# Altium schematic sheet 28Pins.SchDoc (part 3 of 3)
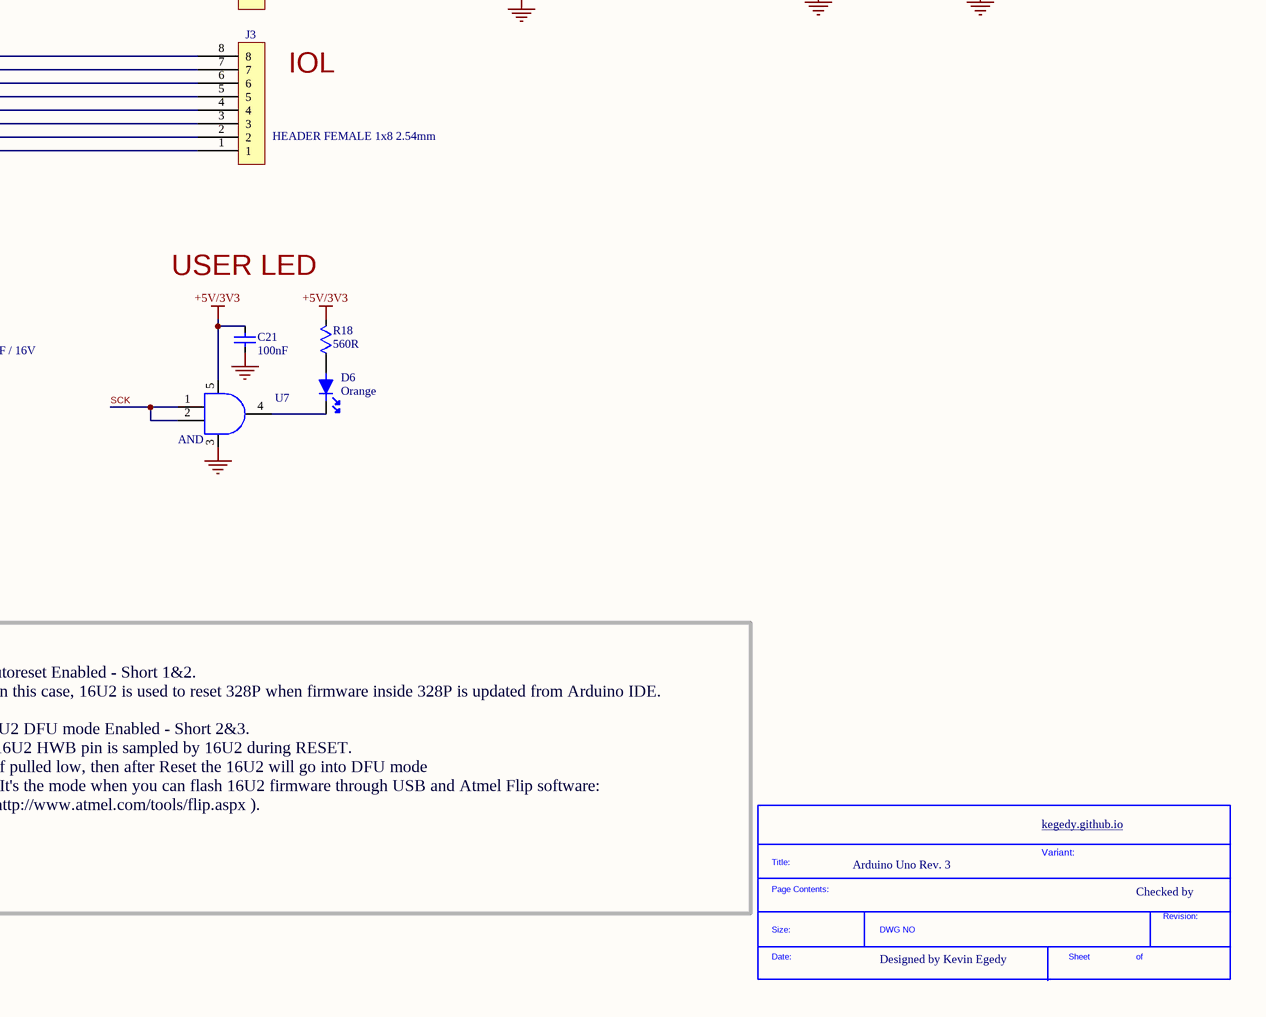
[diagram p5: 28Pins.SchDoc, bottom right]

## Library data of the parts (continued)
R6 R8 R11 R12 R18 = RC0805FR-07560RL: Res General Purpose Thick Film 0805 560 Ohm 1% 1/8W ±100ppm/°C Molded Paper T/R; Manufacturer: Yageo; Power Rating: 125mW; Voltage Rating: 150V; Supplier 1: Digi-Key; Manufacturer Part Number: RC0805FR-07560RL; RoHS: Yes; Category: Chip SMD Resistors; Stock 1: 291591; Pricing 1: 1=0.10000, 10=0.03300, 100=0.01330, 1000=0.00600, 2500=0.00520 (USD); Case/Package: 0805; Case Code (Metric): 2012; Case Code (Imperial): 0805; Weight: 0.000194oz; Min Operating Temperature: -55°C; Max Operating Temperature: 155°C; Resistor Type: Thick Film; Tolerance: 1%; Value: 560R; Package Quantity: 1; Packaging: Cut Tape; Number of Terminations: 2; Termination: SMD/SMT; Max Power Dissipation: 125mW; Temperature Coefficient: 100ppm/°C; Features: Moisture Resistant; Series: RC; Resistance Tolerance: 1%; Construction: Rectangular; Length: 0.079inch; Width: 0.049inch; Height: 0.024inch; Depth: 1.25mm; RoHS Compliant: Yes; Military Standard: Not; Lead Free: Lead Free; ComponentLink1URL: https://datasheet.ciiva.com/2457/pyu-r-int-thick-7-2457141.pdf?src-supplier=Digi-Key; ComponentLink1Description: https://datasheet.ciiva.com/2457/pyu-r-int-thick-7-2457141.pdf?src-supplier=Digi-Key; ComponentLink2URL: https://datasheet.ciiva.com/2457/pyu-r-int-thick-7-2457142.pdf?src-supplier=Digi-Key; ComponentLink2Description: https://datasheet.ciiva.com/2457/pyu-r-int-thick-7-2457142.pdf?src-supplier=Digi-Key; ComponentLink3URL: https://datasheet.ciiva.com/2457/pyu-r-int-thick-7-2457140.pdf?src-supplier=Digi-Key; ComponentLink3Description: https://datasheet.ciiva.com/2457/pyu-r-int-thick-7-2457140.pdf?src-supplier=Digi-Key; ComponentLink4URL: https://datasheet.ciiva.com/5561/rc0805-5561861.pdf?src-supplier=Mouser; ComponentLink4Description: https://datasheet.ciiva.com/5561/rc0805-5561861.pdf?src-supplier=Mouser; ComponentLink5URL: https://datasheet.ciiva.com/7941/444164-7941814.pdf?src-supplier=Element14; ComponentLink5Description: https://datasheet.ciiva.com/7941/444164-7941814.pdf?src-supplier=Element14; ComponentLink6URL: https://datasheet.ciiva.com/7941/444164-7941813.pdf?src-supplier=Element14; ComponentLink6Description: https://datasheet.ciiva.com/7941/444164-7941813.pdf?src-supplier=Element14; Supplier Part Number 1: 311-560CRCT-ND
R10 = RC0805FR-07100KL: Res Thick Film 0805 100K Ohm 1% 1/8W ±100ppm/°C Molded SMD Paper T/R; Manufacturer: Yageo; Value: 100kR; Power Rating: 125mW; Voltage Rating (DC): 150V; Supplier 1: Digi-Key; Manufacturer Part Number: RC0805FR-07100KL; RoHS: Yes; Category: Chip SMD Resistors; Stock 1: 5892950; Pricing 1: 1=0.10000, 10=0.03300, 100=0.01330, 1000=0.00600, 2500=0.00520 (USD); Case/Package: 0805; Pins: 2; Case Code (Metric): 2012; Case Code (Imperial): 0805; Min Operating Temperature: -55°C; Max Operating Temperature: 155°C; Resistor Type: Thick Film; Tolerance: 1%; Packaging: Tape and Reel; Temperature Coefficient: 100ppm/°C; Voltage Rating: 150V; Package Quantity: 1; Number of Terminations: 2; Termination: SMD/SMT; Max Power Dissipation: 125mW; Features: Moisture Resistant; Series: RC; Construction: Rectangular; Resistance Tolerance: 1%; Technology: THICK FILM; Length: 0.079inch; Width: 0.049inch; Height: 0.024inch; Depth: 1.25mm; Lead Pitch: 0.4mm; Lead Free: Lead Free; RoHS Compliant: Yes; Military Standard: Not; ComponentLink1URL: https://datasheet.ciiva.com/11808/0900766b8106beab-11808858.pdf?src-supplier=Rs; ComponentLink1Description: https://datasheet.ciiva.com/11808/0900766b8106beab-11808858.pdf?src-supplier=Rs; ComponentLink2URL: https://datasheet.ciiva.com/7941/1686128-7941677.pdf?src-supplier=Element14; ComponentLink2Description: https://datasheet.ciiva.com/7941/1686128-7941677.pdf?src-supplier=Element14; ComponentLink3URL: https://datasheet.ciiva.com/7660/38627-7660796.pdf?src-supplier=Element14; ComponentLink3Description: https://datasheet.ciiva.com/7660/38627-7660796.pdf?src-supplier=Element14; ComponentLink4URL: https://datasheet.ciiva.com/22747/444164-22747534.pdf?src-supplier=Element14; ComponentLink4Description: https://datasheet.ciiva.com/22747/444164-22747534.pdf?src-supplier=Element14; ComponentLink5URL: https://datasheet.ciiva.com/2457/pyu-r-int-thick-7-2457018.pdf?src-supplier=Digi-Key; ComponentLink5Description: https://datasheet.ciiva.com/2457/pyu-r-int-thick-7-2457018.pdf?src-supplier=Digi-Key; ComponentLink6URL: https://datasheet.ciiva.com/2457/pyu-r-int-thick-7-2457019.pdf?src-supplier=Digi-Key; ComponentLink6Description: https://datasheet.ciiva.com/2457/pyu-r-int-thick-7-2457019.pdf?src-supplier=Digi-Key; ComponentLink7URL: https://datasheet.ciiva.com/2457/pyu-r-int-thick-7-2457017.pdf?src-supplier=Digi-Key; ComponentLink7Description: https://datasheet.ciiva.com/2457/pyu-r-int-thick-7-2457017.pdf?src-supplier=Digi-Key; ComponentLink8URL: https://datasheet.ciiva.com/12667/rc0805-12667001.pdf?src-supplier=Mouser; ComponentLink8Description: https://datasheet.ciiva.com/12667/rc0805-12667001.pdf?src-supplier=Mouser; ComponentLink9URL: https://datasheet.ciiva.com/7941/1697719-7941676.pdf?src-supplier=Element14; ComponentLink9Description: https://datasheet.ciiva.com/7941/1697719-7941676.pdf?src-supplier=Element14; ComponentLink10URL: https://datasheet.ciiva.com/7941/1697719-7941678.pdf?src-supplier=Element14; ComponentLink10Description: https://datasheet.ciiva.com/7941/1697719-7941678.pdf?src-supplier=Element14; ComponentLink11URL: https://datasheet.ciiva.com/16747/rc0805-16747226.pdf?src-supplier=Future+Electronics; ComponentLink11Description: https://datasheet.ciiva.com/16747/rc0805-16747226.pdf?src-supplier=Future+Electronics; Supplier Part Number 1: 311-100KCRCT-ND
R16 R22 = RC0805FR-071ML: Res Thick Film 0805 1M Ohm 1% 0.125W(1/8W) ±100ppm/C Pad SMD T/R; Manufacturer: Yageo; Power Rating: 125mW; Value: 1MR; Voltage Rating: 150V; Temperature Coefficient: 250ppm/°C; Supplier 1: Digi-Key; Manufacturer Part Number: RC0805FR-071ML; RoHS: Yes; Category: Chip SMD Resistors; Stock 1: 1798431; Pricing 1: 1=0.10000, 10=0.03300, 100=0.01330, 1000=0.00600, 2500=0.00520 (USD); Case/Package: Molded; Case Code (Metric): 2012; Case Code (Imperial): 0805; Min Operating Temperature: -55°C; Max Operating Temperature: 155°C; Resistor Type: Thick Film; Package Quantity: 1; Tolerance: 1%; Packaging: Tape and Reel; Number of Terminations: 2; Termination: SMD/SMT; Max Power Dissipation: 125mW; Features: Moisture Resistant; Series: RC; Construction: Rectangular; Resistance Tolerance: 1%; Length: 2mm; Width: 0.049inch; Height: 0.024inch; Depth: 1.25mm; RoHS Compliant: Yes; Military Standard: Not; Lead Free: Lead Free; ComponentLink1URL: https://datasheet.ciiva.com/12666/rc0805-12666975.pdf?src-supplier=Mouser; ComponentLink1Description: https://datasheet.ciiva.com/12666/rc0805-12666975.pdf?src-supplier=Mouser; ComponentLink2URL: https://datasheet.ciiva.com/2519/pyu-r-int-thick-7-2519711.pdf?src-supplier=Digi-Key; ComponentLink2Description: https://datasheet.ciiva.com/2519/pyu-r-int-thick-7-2519711.pdf?src-supplier=Digi-Key; ComponentLink3URL: https://datasheet.ciiva.com/2519/pyu-r-int-thick-7-2519712.pdf?src-supplier=Digi-Key; ComponentLink3Description: https://datasheet.ciiva.com/2519/pyu-r-int-thick-7-2519712.pdf?src-supplier=Digi-Key; ComponentLink4URL: https://datasheet.ciiva.com/2519/pyu-r-int-thick-7-2519713.pdf?src-supplier=Digi-Key; ComponentLink4Description: https://datasheet.ciiva.com/2519/pyu-r-int-thick-7-2519713.pdf?src-supplier=Digi-Key; ComponentLink5URL: https://datasheet.ciiva.com/17419/rc0805-17419909.pdf?src-supplier=Future+Electronics; ComponentLink5Description: https://datasheet.ciiva.com/17419/rc0805-17419909.pdf?src-supplier=Future+Electronics; Supplier Part Number 1: 311-1.00MCRDKR-ND
R23-R25 = RC0805FR-071KL: RES SMD 1K OHM 1% 1/8W 0805; Manufacturer: Yageo; Value: 1kR; Temperature Coefficient: 100ppm/°C; Voltage Rating (DC): 150V; Power Rating: 125mW; Supplier 1: Digi-Key; Manufacturer Part Number: RC0805FR-071KL; RoHS: Yes; Category: Chip SMD Resistors; Stock 1: 8245666; Pricing 1: 1=0.10000, 10=0.03300, 100=0.01330, 1000=0.00600, 2500=0.00520 (USD); Case/Package: 0805; Pins: 2; Case Code (Metric): 2012; Case Code (Imperial): 0805; Min Operating Temperature: -55°C; Max Operating Temperature: 155°C; Tolerance: 1%; Resistor Type: Thick Film; Packaging: Tape and Reel; Package Quantity: 1; Voltage Rating: 150V; Number of Terminations: 2; Termination: SMD/SMT; Max Power Dissipation: 125mW; Features: Moisture Resistant; Series: RC; Resistance Tolerance: 1%; Construction: Rectangular; Length: 0.079inch; Width: 0.049inch; Height: 0.024inch; Depth: 1.25mm; Reach SVHC Compliant: Yes; Lead Free: Lead Free; RoHS Compliant: Yes; Military Standard: Not; ComponentLink1URL: https://datasheet.ciiva.com/7941/1686128-7941719.pdf?src-supplier=Element14; ComponentLink1Description: https://datasheet.ciiva.com/7941/1686128-7941719.pdf?src-supplier=Element14; ComponentLink2URL: https://datasheet.ciiva.com/46385/444164-46385020.pdf?src-supplier=Element14; ComponentLink2Description: https://datasheet.ciiva.com/46385/444164-46385020.pdf?src-supplier=Element14; ComponentLink3URL: https://datasheet.ciiva.com/2456/pyu-r-int-thick-7-2456976.pdf?src-supplier=Digi-Key; ComponentLink3Description: https://datasheet.ciiva.com/2456/pyu-r-int-thick-7-2456976.pdf?src-supplier=Digi-Key; ComponentLink4URL: https://datasheet.ciiva.com/2456/pyu-r-int-thick-7-2456977.pdf?src-supplier=Digi-Key; ComponentLink4Description: https://datasheet.ciiva.com/2456/pyu-r-int-thick-7-2456977.pdf?src-supplier=Digi-Key; ComponentLink5URL: https://datasheet.ciiva.com/2456/pyu-r-int-thick-7-2456975.pdf?src-supplier=Digi-Key; ComponentLink5Description: https://datasheet.ciiva.com/2456/pyu-r-int-thick-7-2456975.pdf?src-supplier=Digi-Key; ComponentLink6URL: https://datasheet.ciiva.com/16850/rc0805-16850409.pdf?src-supplier=Future+Electronics; ComponentLink6Description: https://datasheet.ciiva.com/16850/rc0805-16850409.pdf?src-supplier=Future+Electronics; Supplier Part Number 1: 311-1.00KCRCT-ND
SCKT1 = 4828-3004-CP: Socket DIP 28Cnts DualWipe 0.3InSpc. PhosphorBronze Nickel KinkedTail 4800Series; Manufacturer: 3M; Number of Contacts: 28; Gender: Female; Insulation Resistance: 5GR; Current Rating: 1A; Pitch: 2.54mm; Row Spacing: 7.62mm; Supplier 1: Digi-Key; Manufacturer Part Number: 4828-3004-CP; RoHS: Yes; Category: Connectors; Stock 1: 14978; Pricing 1: 1=1.06000, 10=0.89600, 25=0.85880, 50=0.84060, 100=0.80410, 250=0.73104, 500=0.65794, 1000=0.58483, 2500=0.53000 (USD); Mounting Technology: Through Hole; Contact Plating: Tin; Contact Material: Bronze; Housing Material: Glass; Insulation Material: Polyester; Contact Finish - Mating: TIN; Min Operating Temperature: -25°C; Max Operating Temperature: 85°C; Number of Rows: 2; Termination: Solder; Orientation: Straight; Packaging: Rail/Tube; Package Quantity: 5600; Number of Positions: 28; Connector Type: DIP; Series: 4800; Length: 35.43mm; Width: 10.16mm; Depth: 10.16mm; Lead Free: Lead Free; RoHS Compliant: Yes; Flammability Rating: UL94 V-0; ComponentLink1URL: https://datasheet.ciiva.com/768/ts1099-768354.pdf?src-supplier=Digi-Key; ComponentLink1Description: https://datasheet.ciiva.com/768/ts1099-768354.pdf?src-supplier=Digi-Key; Supplier Part Number 1: 3M5480-ND
SW1 SW2 = 1825910-6: Switch Tactile OFF (ON) SPST Round Button PC Pins 0.05A 24VDC 1.57N Thru-Hole Loose; Manufacturer: TE Connectivity Alcoswitch; Mechanical Life: 100000Cycles; Actuator Material: PBT; Actuator Color: Black; Operating Force: 160gf; Illumination Type: Non-Illuminated,Illuminated; Switch Travel: 0.25mm; Contact Current Rating: 50mA; Switch Function: Off-Mom; Max Voltage Rating (DC): 24V; Contact Resistance: 100mR; Actuator Type: Standard; Actuator Length: 0.055inch; Supplier 1: Digi-Key; Manufacturer Part Number: 1825910-6; RoHS: Yes; Category: Pushbutton Switches; Stock 1: 79914; Pricing 1: 1=0.13000, 10=0.12500, 25=0.11840, 100=0.10780, 250=0.10132, 500=0.09268, 1000=0.07759, 2500=0.07544, 5000=0.07113 (USD); Mounting Technology: Through Hole; Contact Material: Copper Alloy; Contact Plating: Silver; Min Operating Temperature: -35°C; Max Operating Temperature: 85°C; Termination: PC Pins; Series: FSMJ; Throw Configuration: SPST; Package Quantity: 750; Packaging: Loose Piece; Orientation: Straight; Type: Switch; Max Current Rating: 50mA; Electrical Life: 100000Cycles; Length: 5.99mm; RoHS Compliant: Yes; ELV: Compliant; Lead Free: Lead Free; ComponentLink1URL: https://datasheet.ciiva.com/30199/1825910-6rqpn1825910-6-30199520.pdf?src-supplier=Onlinecomponents.com; ComponentLink1Description: https://datasheet.ciiva.com/30199/1825910-6rqpn1825910-6-30199520.pdf?src-supplier=Onlinecomponents.com; ComponentLink2URL: https://datasheet.ciiva.com/15184/getdatasheetpartid-395915-15184509.pdf?src-supplier=Verical; ComponentLink2Description: https://datasheet.ciiva.com/15184/getdatasheetpartid-395915-15184509.pdf?src-supplier=Verical; Supplier Part Number 1: 450-1650-ND
U1 = ATMEGA328P-PU: ATMEGA328P-PU; 8 bit Microcontroller AVR 20MHz 1; 32kb Flash; 2kb RAM; I2C SPI 2; Manufacturer: Microchip / Atmel; Number of PWM Channels: 6; Number of Timers/Counters: 3; Min Supply Voltage: 1.8V; Max Supply Voltage: 5.5V; Interface: I2C,SPI,UART,USART,2-Wire; Number of I/Os: 23; Oscillator Type: Internal; Data Bus Width: 8b; Number of SPI Channels: 1; Watchdog Timer: Yes; Peripherals: Brown-out Detect/Reset,POR,PWM,WDT; Supplier 1: Digi-Key; Manufacturer Part Number: ATMEGA328P-PU; RoHS: Yes; Category: Microcontrollers; Mount: Through Hole; Case/Package: PDIP; Number of Pins: 28; Contact Plating: Tin,Matte; Min Operating Temperature: -40°C; Max Operating Temperature: 85°C; Package Quantity: 14; Core Architecture: AVR; Series: AVR® ATmega; RAM Size: 2KB; Number of ADC Channels: 6; Packaging: Rail/Tube; Frequency: 20MHz; Number of Programmable I/O: 23; Max Frequency: 20MHz; Number of I2C Channels: 1; Memory Type: FLASH; Memory Size: 32KB; Length: 37.4mm; Width: 6.76mm; Height: 3.28mm; Radiation Hardening: No; REACH SVHC: No SVHC; Lead Free: Lead Free; RoHS Compliant: Yes; ComponentLink1URL: https://datasheet.ciiva.com/19457/2139111-19457070.pdf?src-supplier=Jameco; ComponentLink1Description: https://datasheet.ciiva.com/19457/2139111-19457070.pdf?src-supplier=Jameco; ComponentLink2URL: https://datasheet.ciiva.com/1157/1684409-1157696.pdf?src-supplier=Element14; ComponentLink2Description: https://datasheet.ciiva.com/1157/1684409-1157696.pdf?src-supplier=Element14; ComponentLink3URL: https://datasheet.ciiva.com/20168/73-4283-20168380.pdf?src-supplier=Rapid+Electronics; ComponentLink3Description: https://datasheet.ciiva.com/20168/73-4283-20168380.pdf?src-supplier=Rapid+Electronics; ComponentLink4URL: https://datasheet.ciiva.com/29119/155197-da-01-en-microcontr-atmega328p-pu-8bit-pdip-28-29119593.pdf?src-supplier=Conrad; ComponentLink4Description: https://datasheet.ciiva.com/29119/155197-da-01-en-microcontr-atmega328p-pu-8bit-pdip-28-29119593.pdf?src-supplier=Conrad; ComponentLink5URL: https://datasheet.ciiva.com/26818/atmega328p-pu-26818578.pdf?src-supplier=IIIC; ComponentLink5Description: https://datasheet.ciiva.com/26818/atmega328p-pu-26818578.pdf?src-supplier=IIIC; ComponentLink6URL: https://datasheet.ciiva.com/15213/getdatasheetpartid-318533-15213133.pdf?src-supplier=Verical; ComponentLink6Description: https://datasheet.ciiva.com/15213/getdatasheetpartid-318533-15213133.pdf?src-supplier=Verical; Supplier Part Number 1: ATMEGA328P-PU-ND
U2 = ATMEGA16U2-AU: 8-bit AVR MCU, 16 KB, 512 Bytes, 16 MHz, 2.7 to 5.5V, TQFP-32, RoHS; Manufacturer: Microchip; Interface: SPI,USB,UART,USART; Memory Type: FLASH; Frequency: 16MHz; Memory Size: 16KB; Peripherals: Brown-out Detect/Reset,POR,PWM,WDT; Number of I/Os: 22; Oscillator Type: Internal; Supplier 1: Digi-Key; Manufacturer Part Number: ATMEGA16U2-AU; RoHS: Yes; Category: Microcontrollers; Pricing 1: 1=3.16000, 25=2.90960, 100=2.63350 (USD); Case/Package: TQFP; Number of Pins: 32; Min Operating Temperature: -40°C; Max Operating Temperature: 85°C; Packaging: Tray; Core Architecture: AVR; RoHS Compliant: Yes; ComponentLink1URL: http://www.farnell.com/datasheets/1795896.pdf?src-supplier=Farnell; ComponentLink1Description: http://www.farnell.com/datasheets/1795896.pdf?src-supplier=Farnell; ComponentLink2URL: http://www.microchip.com/mymicrochip/filehandler.aspx?ddocname=en590463&src-supplier=Onlinecomponents.com; ComponentLink2Description: http://www.microchip.com/mymicrochip/filehandler.aspx?ddocname=en590463&src-supplier=Onlinecomponents.com; ComponentLink3URL: http://www.microchip.com/mymicrochip/filehandler.aspx?ddocname=en590463&src-supplier=RSComponents; ComponentLink3Description: http://www.microchip.com/mymicrochip/filehandler.aspx?ddocname=en590463&src-supplier=RSComponents; ComponentLink4URL: http://www.farnell.com/datasheets/1795896.pdf?src-supplier=Element14; ComponentLink4Description: http://www.farnell.com/datasheets/1795896.pdf?src-supplier=Element14; ComponentLink5URL: http://www.microchip.com/mymicrochip/filehandler.aspx?ddocname=en590463&src-supplier=Mouser; ComponentLink5Description: http://www.microchip.com/mymicrochip/filehandler.aspx?ddocname=en590463&src-supplier=Mouser; ComponentLink6URL: http://www.microchip.com/mymicrochip/filehandler.aspx?ddocname=en590463&src-supplier=Avnet; ComponentLink6Description: http://www.microchip.com/mymicrochip/filehandler.aspx?ddocname=en590463&src-supplier=Avnet; ComponentLink7URL: http://www.microchip.com/mymicrochip/filehandler.aspx?ddocname=en590463&src-supplier=Arrow+Electronics; ComponentLink7Description: http://www.microchip.com/mymicrochip/filehandler.aspx?ddocname=en590463&src-supplier=Arrow+Electronics; ComponentLink8URL: http://www.microchip.com/mymicrochip/filehandler.aspx?ddocname=en590463&src-supplier=Verical; ComponentLink8Description: http://www.microchip.com/mymicrochip/filehandler.aspx?ddocname=en590463&src-supplier=Verical; ComponentLink9URL: http://www.microchip.com/mymicrochip/filehandler.aspx?ddocname=en590463&src-supplier=Avnet+Europe; ComponentLink9Description: http://www.microchip.com/mymicrochip/filehandler.aspx?ddocname=en590463&src-supplier=Avnet+Europe; ComponentLink10URL: http://www.microchip.com/mymicrochip/filehandler.aspx?ddocname=en590463&src-supplier=Avnet+Asia; ComponentLink10Description: http://www.microchip.com/mymicrochip/filehandler.aspx?ddocname=en590463&src-supplier=Avnet+Asia; ComponentLink11URL: http://www.microchip.com/mymicrochip/filehandler.aspx?ddocname=en590463&src-supplier=Digi-Key; ComponentLink11Description: http://www.microchip.com/mymicrochip/filehandler.aspx?ddocname=en590463&src-supplier=Digi-Key; ComponentLink12URL: http://www.microchip.com/mymicrochip/filehandler.aspx?ddocname=en590463&src-supplier=TME; ComponentLink12Description: http://www.microchip.com/mymicrochip/filehandler.aspx?ddocname=en590463&src-supplier=TME; ComponentLink13URL: http://www.microchip.com/mymicrochip/filehandler.aspx?ddocname=en590463&src-supplier=microchipDIRECT; ComponentLink13Description: http://www.microchip.com/mymicrochip/filehandler.aspx?ddocname=en590463&src-supplier=microchipDIRECT; ComponentLink14URL: http://www.microchip.com/mymicrochip/filehandler.aspx?ddocname=en590463&src-supplier=Electro+Sonic; ComponentLink14Description: http://www.microchip.com/mymicrochip/filehandler.aspx?ddocname=en590463&src-supplier=Electro+Sonic; Supplier Part Number 1: ATMEGA16U2-AU-ND
U3 = TL1963A-33DCQR: LDO Regulator Pos 3.3V 1.5A 6-Pin(5+Tab) SOT-223 T/R; Manufacturer: Texas Instruments; Dropout Voltage: 340mV; Number of Outputs: 1; Max Supply Voltage: 20V; Min Input Voltage: 2.1V; Min Current Limit: 1.6A; Input Bias Current: 1mA; Polarity: Positive; Accuracy: 3%; Output Type: Fixed; Supplier 1: Digi-Key; Manufacturer Part Number: TL1963A-33DCQR; RoHS: Yes; Category: Voltage Regulators - Linear; Pricing 1: 1=3.62000, 10=3.25200, 25=3.07440, 100=2.66440, 250=2.52772, 500=2.26812, 1000=1.93350 (USD); Case/Package: SOT-223; Pins: 6; Contact Plating: Gold; Min Operating Temperature: -40°C; Max Operating Temperature: 125°C; Package Quantity: 1; Packaging: Tape and Reel; Output Voltage: 3.3V; Output Current: 1.5A; Max Output current: 1.5A; Number of Regulators: 1; Quiescent Current: 1mA; Max Output Voltage: 3.3V; Min Output Voltage: 3.3V; Series: -; Radiation Hardening: No; Lead Free: Lead Free; RoHS Compliant: Yes; ComponentLink1URL: https://datasheet.ciiva.com/2046/tl1963a-2046162.pdf?src-supplier=Digi-Key; ComponentLink1Description: https://datasheet.ciiva.com/2046/tl1963a-2046162.pdf?src-supplier=Digi-Key; ComponentLink2URL: https://datasheet.ciiva.com/2046/tl1963a-2046161.pdf?src-supplier=Digi-Key; ComponentLink2Description: https://datasheet.ciiva.com/2046/tl1963a-2046161.pdf?src-supplier=Digi-Key; ComponentLink3URL: https://datasheet.ciiva.com/2046/tl1963a-2046163.pdf?src-supplier=Digi-Key; ComponentLink3Description: https://datasheet.ciiva.com/2046/tl1963a-2046163.pdf?src-supplier=Digi-Key; Supplier Part Number 1: 296-24534-6-ND
U4-U7 = SN74AHC1G09DCKR: SN74AHC1G09 Single 2-INPUT Posit; Manufacturer: Texas Instruments; Max Supply Voltage: 5.5V; Min Supply Voltage: 2V; Logic Function: AND GATE; Quiescent Current: 1uA; Output Current: 25mA; Number of Inputs: 2; Propagation Delay: 7.5ns; Number of Circuits: 1; Low Level Output Current: 8mA; Supplier 1: Digi-Key; Manufacturer Part Number: SN74AHC1G09DCKR; RoHS: Yes; Category: Logic Gates; Stock 1: 971; Pricing 1: 1=0.40000, 10=0.29700, 25=0.25960, 100=0.16810, 250=0.13912, 500=0.11130, 1000=0.08533 (USD); Mounting Technology: Surface Mount; Case/Package: SC; Pins: 5; Min Operating Temperature: -55°C; Max Operating Temperature: 125°C; Packaging: Tape and Reel; Package Quantity: 1; Number of Gates: 1; Number of Elements: 1; Number of Bits: 1; Series: 74AHC; Technology: CMOS; Number of Outputs: 1; Output Voltage: 5.5V; Radiation Hardening: No; Lead Free: Lead Free; RoHS Compliant: Yes; Reach SVHC Compliant: Yes; ComponentLink1URL: https://datasheet.ciiva.com/1869/sn74ahc1g09-1869442.pdf?src-supplier=Digi-Key; ComponentLink1Description: https://datasheet.ciiva.com/1869/sn74ahc1g09-1869442.pdf?src-supplier=Digi-Key; ComponentLink2URL: https://datasheet.ciiva.com/4817/scls724b-115396-4817364.pdf?src-supplier=Mouser; ComponentLink2Description: https://datasheet.ciiva.com/4817/scls724b-115396-4817364.pdf?src-supplier=Mouser; ComponentLink3URL: https://datasheet.ciiva.com/41677/1864448-41677365.pdf?src-supplier=Newark; ComponentLink3Description: https://datasheet.ciiva.com/41677/1864448-41677365.pdf?src-supplier=Newark; ComponentLink4URL: https://datasheet.ciiva.com/1869/sn74ahc1g09-1869443.pdf?src-supplier=Digi-Key; ComponentLink4Description: https://datasheet.ciiva.com/1869/sn74ahc1g09-1869443.pdf?src-supplier=Digi-Key; ComponentLink5URL: https://datasheet.ciiva.com/1869/sn74ahc1g09-1869444.pdf?src-supplier=Digi-Key; ComponentLink5Description: https://datasheet.ciiva.com/1869/sn74ahc1g09-1869444.pdf?src-supplier=Digi-Key; ComponentLink6URL: https://datasheet.ciiva.com/14310/sn74ahc1g09-14310535.pdf?src-supplier=Avnet; ComponentLink6Description: https://datasheet.ciiva.com/14310/sn74ahc1g09-14310535.pdf?src-supplier=Avnet; Supplier Part Number 1: 296-29203-1-ND
Y1 Y2 = ABM7-16.000MHZ-D2Y-T: Crystal 16MHz ±20ppm (Tol) ±30ppm (Stability) 18pF FUND 50Ohm 2-Pin Mini-CSMD T/R; Manufacturer: Abracon; ESR (Equivalent Series Resistance): 50R; Supplier 1: Digi-Key; Manufacturer Part Number: ABM7-16.000MHZ-D2Y-T; RoHS: Yes; Category: Crystals; Stock 1: 2620; Pricing 1: 1=0.67000, 10=0.55600, 50=0.50000, 100=0.44440, 500=0.42218 (USD); Mounting Technology: Surface Mount; Case/Package: CSMD; Pins: 2; Min Operating Temperature: -40°C; Max Operating Temperature: 85°C; Frequency Tolerance: 20ppm; Load Capacitance: 18pF; Frequency: 16MHz; Package Quantity: 1000; Tolerance: 20ppm; Packaging: Tape and Reel; Frequency Stability: 30ppm; Termination: SMD/SMT; Resistor Type: Ceramic; Series: ABM7; Operating Frequency: 16 MHz; Length: 6mm; Width: 3.3mm; Height: 1.4mm; Depth: 3.5mm; Radiation Hardening: No; Lead Free: Lead Free; ComponentLink1URL: https://datasheet.ciiva.com/15116/getdatasheetpartid-721624-15116835.pdf?src-supplier=Verical; ComponentLink1Description: https://datasheet.ciiva.com/15116/getdatasheetpartid-721624-15116835.pdf?src-supplier=Verical; ComponentLink2URL: https://datasheet.ciiva.com/5788/abm7-5788054.pdf?src-supplier=Farnell; ComponentLink2Description: https://datasheet.ciiva.com/5788/abm7-5788054.pdf?src-supplier=Farnell; ComponentLink3URL: https://datasheet.ciiva.com/7998/947971-7998600.pdf?src-supplier=Element14; ComponentLink3Description: https://datasheet.ciiva.com/7998/947971-7998600.pdf?src-supplier=Element14; ComponentLink4URL: https://datasheet.ciiva.com/22658/947971-22658293.pdf?src-supplier=Element14; ComponentLink4Description: https://datasheet.ciiva.com/22658/947971-22658293.pdf?src-supplier=Element14; ComponentLink5URL: https://datasheet.ciiva.com/46385/947971-46385243.pdf?src-supplier=Element14; ComponentLink5Description: https://datasheet.ciiva.com/46385/947971-46385243.pdf?src-supplier=Element14; ComponentLink6URL: https://datasheet.ciiva.com/18649/abm7-18649866.pdf?src-supplier=Digi-Key; ComponentLink6Description: https://datasheet.ciiva.com/18649/abm7-18649866.pdf?src-supplier=Digi-Key; ComponentLink7URL: https://datasheet.ciiva.com/18649/abm7-18649865.pdf?src-supplier=Digi-Key; ComponentLink7Description: https://datasheet.ciiva.com/18649/abm7-18649865.pdf?src-supplier=Digi-Key; ComponentLink8URL: https://datasheet.ciiva.com/18649/abm7-18649867.pdf?src-supplier=Digi-Key; ComponentLink8Description: https://datasheet.ciiva.com/18649/abm7-18649867.pdf?src-supplier=Digi-Key; ComponentLink9URL: https://datasheet.ciiva.com/16383/abm7-16383174.pdf?src-supplier=Future+Electronics; ComponentLink9Description: https://datasheet.ciiva.com/16383/abm7-16383174.pdf?src-supplier=Future+Electronics; ComponentLink10URL: https://datasheet.ciiva.com/26941/getdatasheetpartid-719818-26941724.pdf?src-supplier=Verical; ComponentLink10Description: https://datasheet.ciiva.com/26941/getdatasheetpartid-719818-26941724.pdf?src-supplier=Verical; Supplier Part Number 1: 535-9840-1-ND
Z1 Z2 = CG0603MLC-05E: ESD Suppressor Multilayer Varistor 5V Automotive 2-Pin Case 0603(1608Metric) T/R; Manufacturer: Bourns; Value: 0.5pF; Voltage Rating (AC): 8V; Number of Channels: 1; Clamping Voltage: 20V; Current Rating: 50nA; Turn-On Delay Time: 1ns; Element Configuration: Single; Supplier 1: Digi-Key; Manufacturer Part Number: CG0603MLC-05E; RoHS: Yes; Category: Varistors; Stock 1: 422595; Pricing 1: 1=0.45000, 10=0.33600, 25=0.30320, 100=0.20960, 250=0.17648, 500=0.14338, 1000=0.11029, 2500=0.09926 (USD); Case/Package: 0603; Pins: 2; Case Code (Imperial): 0603; Case Code (Metric): 1608; Contact Plating: Tin; Min Operating Temperature: -40°C; Max Operating Temperature: 85°C; Voltage Rating (DC): 5V; Operating Supply Voltage: 5V; Package Quantity: 1; Packaging: Tape and Reel; Termination: SMD/SMT; Voltage: 5V; Number of Circuits: 1; Max Voltage Rating (DC): 5V; Working Voltage: 5V; Leakage Current: 50nA; Series: MLC; Length: 1.6mm; Width: 0.8mm; Depth: 0.8mm; Thickness: 0.8mm; Radiation Hardening: No; Reach SVHC Compliant: Yes; RoHS Compliant: Yes; ComponentLink1URL: https://datasheet.ciiva.com/27747/1163231-27747629.pdf?src-supplier=Jameco; ComponentLink1Description: https://datasheet.ciiva.com/27747/1163231-27747629.pdf?src-supplier=Jameco; ComponentLink2URL: https://datasheet.ciiva.com/1278/1785244-1278701.pdf?src-supplier=Element14; ComponentLink2Description: https://datasheet.ciiva.com/1278/1785244-1278701.pdf?src-supplier=Element14; ComponentLink3URL: https://datasheet.ciiva.com/8084/mlc-8084047.pdf?src-supplier=Avnet; ComponentLink3Description: https://datasheet.ciiva.com/8084/mlc-8084047.pdf?src-supplier=Avnet; ComponentLink4URL: https://datasheet.ciiva.com/6991/mlc-6991832.pdf?src-supplier=Digi-Key; ComponentLink4Description: https://datasheet.ciiva.com/6991/mlc-6991832.pdf?src-supplier=Digi-Key; ComponentLink5URL: https://datasheet.ciiva.com/6991/mlc-6991834.pdf?src-supplier=Digi-Key; ComponentLink5Description: https://datasheet.ciiva.com/6991/mlc-6991834.pdf?src-supplier=Digi-Key; ComponentLink6URL: https://datasheet.ciiva.com/6991/mlc-6991836.pdf?src-supplier=Digi-Key; ComponentLink6Description: https://datasheet.ciiva.com/6991/mlc-6991836.pdf?src-supplier=Digi-Key; ComponentLink7URL: https://datasheet.ciiva.com/30070/mlc-30070503.pdf?src-supplier=Onlinecomponents.com; ComponentLink7Description: https://datasheet.ciiva.com/30070/mlc-30070503.pdf?src-supplier=Onlinecomponents.com; ComponentLink8URL: https://datasheet.ciiva.com/22696/1785244-22696318.pdf?src-supplier=Element14; ComponentLink8Description: https://datasheet.ciiva.com/22696/1785244-22696318.pdf?src-supplier=Element14; Supplier Part Number 1: CG0603MLC-05ECT-ND